# EAGLE design telemetry-daughter (EAGLE 7.7.0)
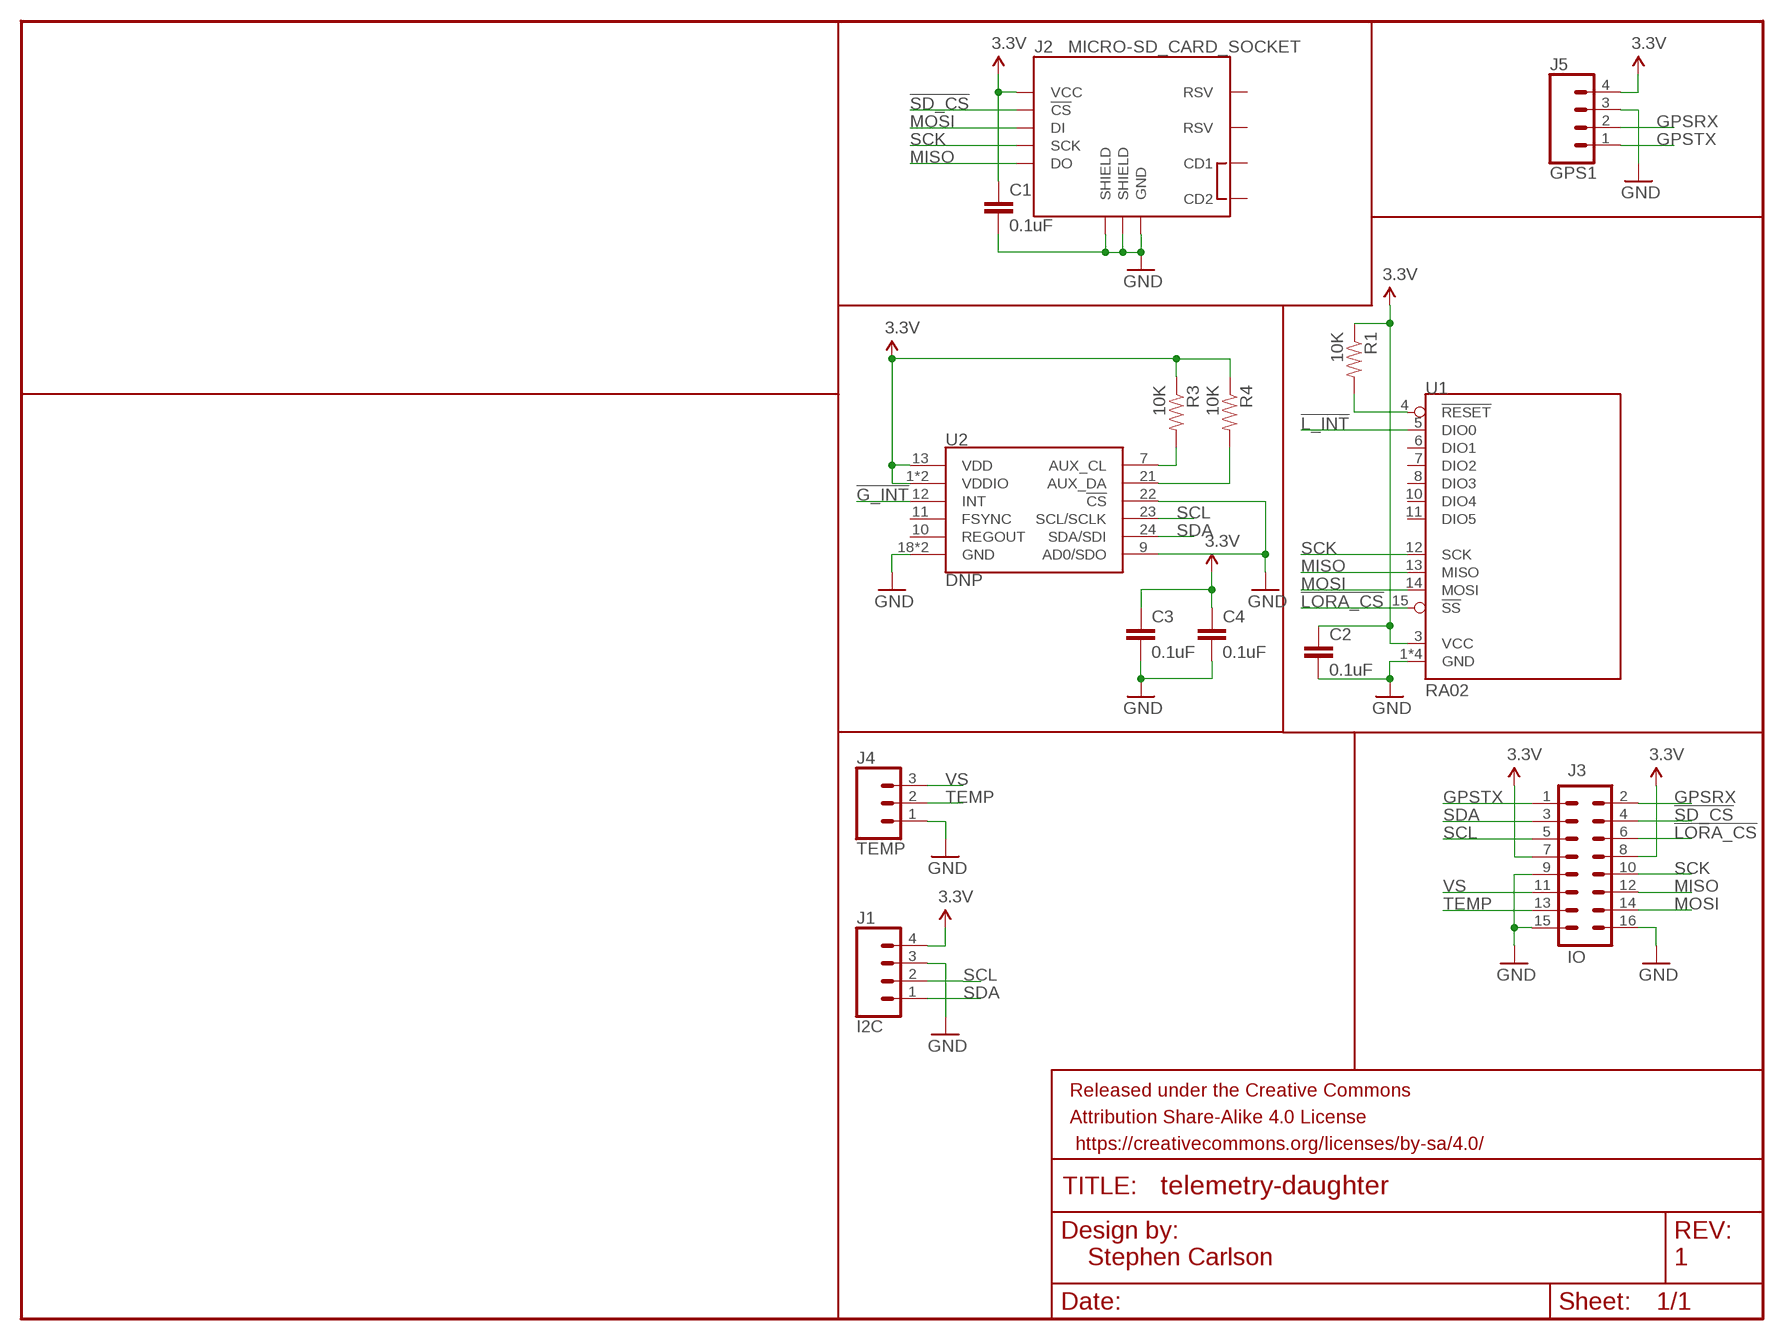
[diagram p0: schematic, sheet 1]

## Parts
C1  0.1uF  0.1UF-0603-25V-(+80/-20%)  [0603]
C2  0.1uF  0.1UF-0603-25V-(+80/-20%)  [0603]
C3  0.1uF  0.1UF-0603-25V-(+80/-20%)  [0603]
C4  0.1uF  0.1UF-0603-25V-(+80/-20%)  [0603]
FRAME1  FRAME-LETTERNO_PACKAGE  [DUMMY]
J1  I2C  CONN_04JST-PTH  [JST-4-PTH]
J2  MICRO-SD_CARD_SOCKET  [MICRO-SD-SOCKET]
J3  IO  M08X2  [2X8]
J4  TEMP  CONN_03JST-PTH  [JST-3-PTH]
J5  GPS1  CONN_04JST-PTH  [JST-4-PTH]
R1  10K  RESISTOR0805-RES  [0805]
R3  10K  RESISTOR0805-RES  [0805]
R4  10K  RESISTOR0805-RES  [0805]
U1  RA02  [RA02]
U2  DNP  MPU-9250  [QFN24-3X3]

## Nets
3.3V: C1.1 C2.1 C3.1 C4.1 J1.4 J2.VCC J3.7 J3.8 J5.4 R1.1 R3.1 R4.1 U1.3(VCC) U2.1(VDDIO) U2.8(VDDIO) U2.13(VDD)
!G_INT!: U2.12(INT)
!L_INT!: U1.5(DIO0)
!LORA_CS!: J3.6 U1.15(!SS!)
!LORA_RST!: R1.2 U1.4(!RESET!)
!SD_CS!: J2.CS(!CS) J3.4
AUX_CL: R3.2 U2.7(AUX_CL)
AUX_DA: R4.2 U2.21(AUX_DA)
GND: C1.2 C2.2 C3.2 C4.2 J1.3 J2.GND J2.GND1(SHIELD) J2.GND3(SHIELD) J3.9 J3.15 J3.16 J4.1 J5.3 U1.1(GND) U1.2(GND) U1.9(GND) U1.16(GND) U2.9(AD0/SDO) U2.18(GND) U2.20(GND) U2.22(!CS)
GPSRX: J3.2 J5.2
GPSTX: J3.1 J5.1
MISO: J2.DO J3.12 U1.13(MISO)
MOSI: J2.DI J3.14 U1.14(MOSI)
SCK: J2.SCLK(SCK) J3.10 U1.12(SCK)
SCL: J1.2 J3.5 U2.23(SCL/SCLK)
SDA: J1.1 J3.3 U2.24(SDA/SDI)
TEMP: J3.13 J4.2
VS: J3.11 J4.3
Unconnected: J2.CD1 J2.CD2 J2.RSV1(RSV) J2.RSV2(RSV) U1.6(DIO1) U1.7(DIO2) U1.8(DIO3) U1.10(DIO4) U1.11(DIO5) U2.10(REGOUT) U2.11(FSYNC)

## Notes on the sheet
- Stephen Carlson | 1

## Library data of the parts
C1-C4 = SparkFun-Capacitors:0.1UF: 0.1µF ceramic capacitors A capacitor is a passive two-terminal electrical component used to store electrical energy temporarily in an electric field.; PROD_ID: CAP-00810
FRAME1 = SparkFun-Aesthetics:FRAME-LETTER: Schematic Frame Standard 8.5x11 US Letter frame; DESIGNER: Nobody; VERSION: v01
J1 J5 = SparkFun-Connectors:CONN_04: Multi connection point. Often used as Generic Header-pin footprint for 0.1 inch spaced/style header connections On any of the 0.1 inch spaced packages, you can populate with these: Break Away Headers - Straight <https://www.sparkfun.com/products/116> (PRT-00116) Break Away Male Headers - Right Angle <https://www.sparkfun.com/products/553> (PRT-00553) Female Headers <https://www.sparkfun.com/products/115> (PRT-00115) Break Away Headers - Machine Pin <https://www.sparkfun.com/products/117> (PRT-00117) Break Away Female Headers - Swiss Machine Pin <https://www.sparkfun.com/products/743> (PRT-00743) For SCREWTERMINALS and SPRING TERMINALS visit here: Screw Terimnals on SparkFun.com <https://www.sparkfun.com/search/results?term=Screw+Terminals> (5mm/3.5mm/2.54mm spacing) This device is also useful as a general connection point to wire up your design to another part of your project. Our various solder wires solder well into these plated through hole pads. Hook-Up Wire - Assortment (Stranded, 22 AWG) <https://www.sparkfun.com/products/11375> (PRT-11375) Hook-Up Wire - Assortment (Solid Core, 22 AWG) <https://www.sparkfun.com/products/11367> (PRT-11367) View the entire wire category on our website here <https://www.sparkfun.com/categories/141> Special notes: Molex polarized connector foot print use with SKU : PRT-08231 with associated crimp pins and housings. 1MM SMD Version SKU: PRT-10208; PROD_ID: WIRE-13531; SF_ID: PRT-09916
J2 = SparkFun-Connectors:MICRO-SD_CARD_SOCKET: microSD Socket for Transflash Push-push type µSD socket. tDoc lines correctly indicate media card edge positions when inserting (unlocked, locked, depressed). NOTE: CD1 and CD2 are connected internally, and the default detect state of the socket is detect pin to ground. SparkFun Products: WAV Trigger <https://www.sparkfun.com/products/13660> CAN-Bus Shield <https://www.sparkfun.com/products/13262> SparkFun Level Shifing microSD Breakout <https://www.sparkfun.com/products/13743>; PROD_ID: CONN-07820; SF_ID: PRT-00127
J3 = SparkFun-Connectors:M08X2: .1" headers, two rows of 8 each
J4 = SparkFun-Connectors:CONN_03: Multi connection point. Often used as Generic Header-pin footprint for 0.1 inch spaced/style header connections On any of the 0.1 inch spaced packages, you can populate with these: Break Away Headers - Straight <https://www.sparkfun.com/products/116> (PRT-00116) Break Away Male Headers - Right Angle <https://www.sparkfun.com/products/553> (PRT-00553) Female Headers <https://www.sparkfun.com/products/115> (PRT-00115) Break Away Headers - Machine Pin <https://www.sparkfun.com/products/117> (PRT-00117) Break Away Female Headers - Swiss Machine Pin <https://www.sparkfun.com/products/743> (PRT-00743) Stackable Header - 3 Pin (Female, 0.1") <https://www.sparkfun.com/products/13875> (PRT-13875) For SCREWTERMINALS and SPRING TERMINALS visit here: Screw Terimnals on SparkFun.com <https://www.sparkfun.com/search/results?term=Screw+Terminals> (5mm/3.5mm/2.54mm spacing) This device is also useful as a general connection point to wire up your design to another part of your project. Our various solder wires solder well into these plated through hole pads. Hook-Up Wire - Assortment (Stranded, 22 AWG) <https://www.sparkfun.com/products/11375> (PRT-11375) Hook-Up Wire - Assortment (Solid Core, 22 AWG) <https://www.sparkfun.com/products/11367> (PRT-11367) View the entire wire category on our website here <https://www.sparkfun.com/categories/141> Special notes: Molex polarized connector foot print use with SKU : PRT-08232 with associated crimp pins and housings.; PROD_ID: WIRE-10037; SF_ID: PRT-09915
R1 R3 R4 = SparkFun-Passives:RESISTOR: Resistor Basic schematic elements and footprints for 0603, 1206, and PTH resistors.
U1 = HAB:RA02: RA-02 LoRA RA-02 LoRA module with integrated u.FL connector
U2 = SparkFun-Sensors:MPU-9250: MPU-9250 9 Degree of Freedom IMU System in Package that contains MPU-6500 & AK8963 NC pin 19. 2-6 & 14-17 not internally connected. May be used for PCB trace routing. Datasheet <https://cdn.sparkfun.com/assets/learn_tutorials/5/5/0/MPU9250REV1.0.pdf> SparkFun Products: SparkFun 9DoF Razor IMU M0 <https://www.sparkfun.com/products/14001> SparkFun IMU Breakout - MPU-9250 <https://www.sparkfun.com/products/13762>; PROD_ID: IC-13192; VALUE: 9DoF IMU

## Board
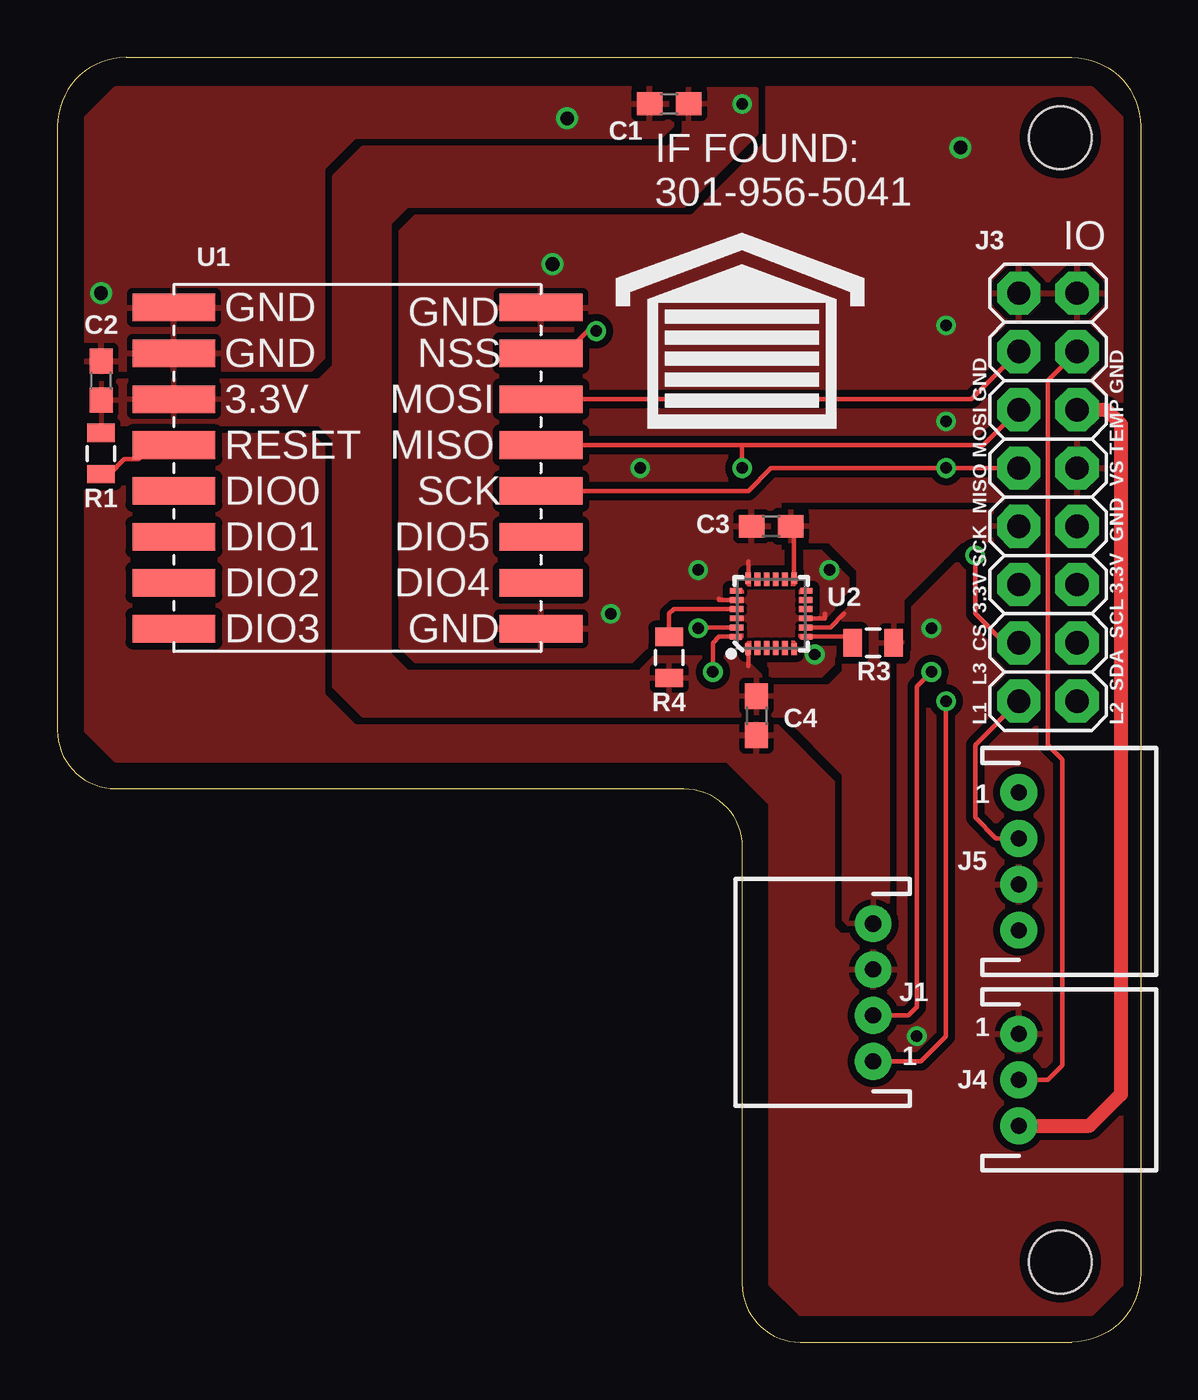
[diagram p1: board, top side]
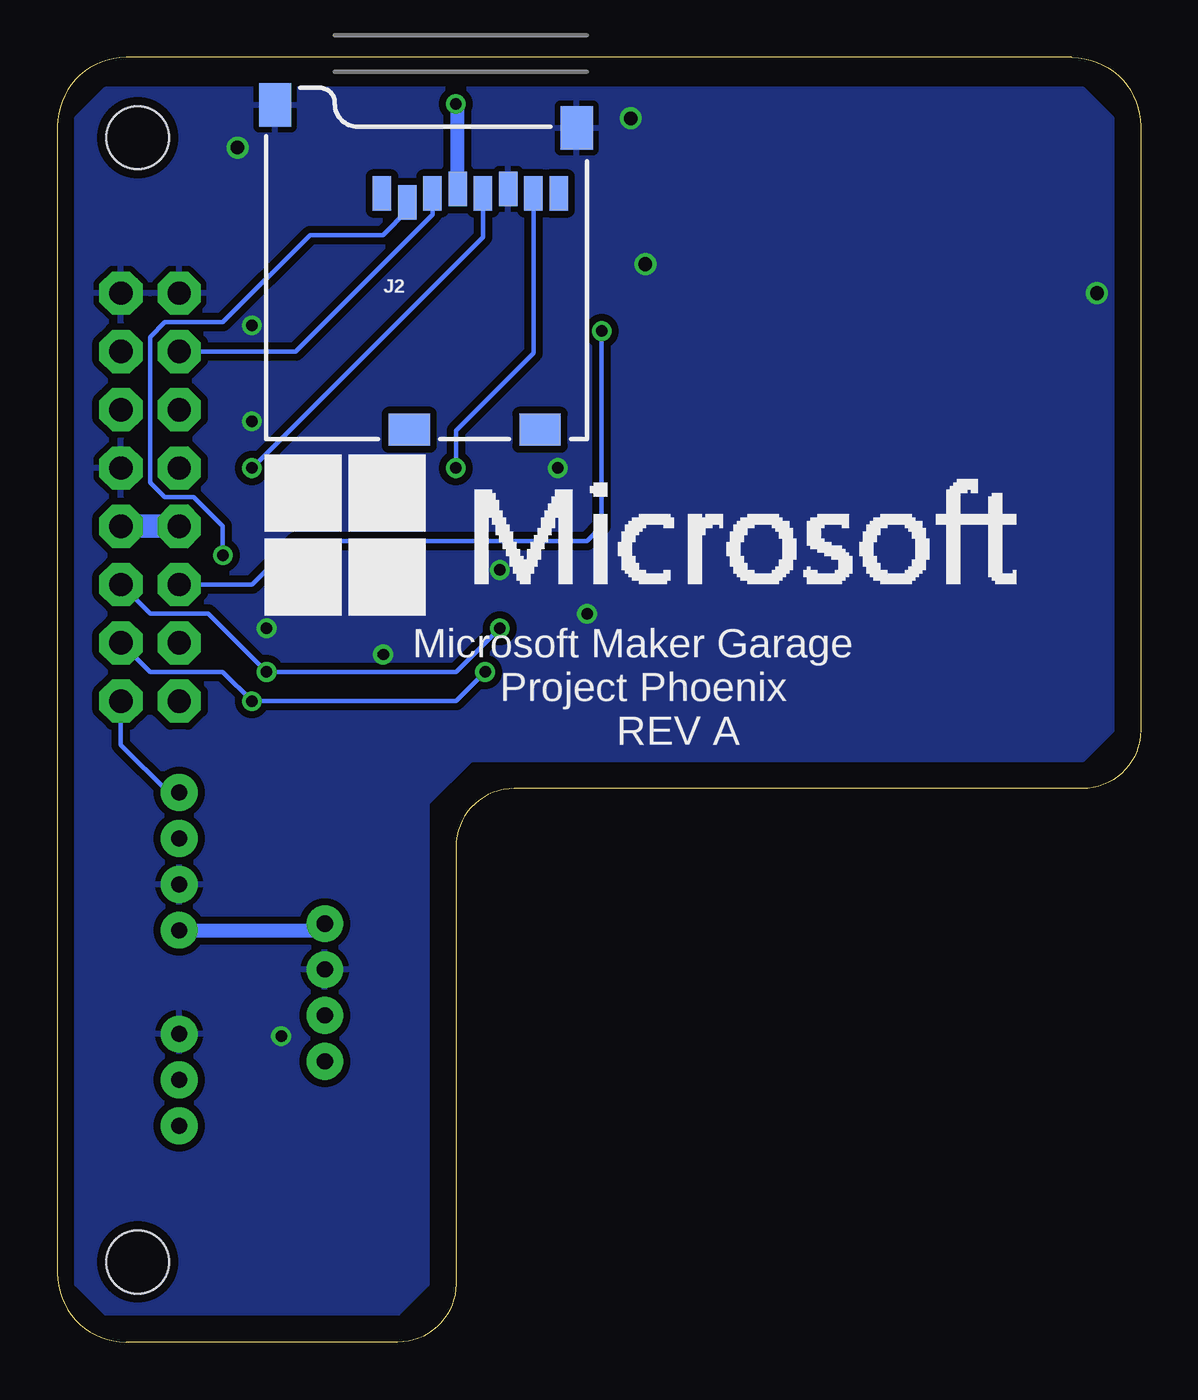
[diagram p2: board, bottom side, seen from below]

Size 47.22 x 56 mm. Coordinates in mm from the lower left corner, seen from the top.
Outline: 0,53 0,26.67 arc90 2.54,24.13 27.3,24.13 arc-90 29.84,21.59 29.84,2.54 arc90 32.38,0 44.22,0 arc90 47.22,3 47.22,53 arc90 44.22,56 3,56 arc90 0,53
Copper layers (1*16): Top 0.0356mm / dielectric 1.5011mm / Bottom 0.0356mm
Design rules "LaenPCBOrder *": minimum track width 6mil, minimum drill 13mil, track to track 6mil, track to pad 6mil, pad to pad 6mil, via to via 6mil, smd to smd 6mil, copper to edge 15mil, drill to drill 6mil, minimum pad ring 7mil, minimum via ring 7mil, stop-mask expansion 2.5mil, vias tented up to drill 0mil, thermal gap 10mil
Holes 2.75 mm at 43.72,3.5 43.72,52.5
tKeepout: area 40.7,0.5 to 46.7,6.5; area 40.7,49.5 to 46.7,55.5

### Footprints (pad centres in the part's own frame; a part is rotated, then mirrored left to right if it is on the bottom)
0603 = smd 1.1 x 1: 1 -0.85,0; 2 0.85,0
JST-4-PTH = drill 0.7 pad 1.6: 1 -3,0; 2 -1,0; 3 1,0; 4 3,0
MICRO-SD-SOCKET = smd 1.8 x 1.4: CD1 -2.05,0.4; CD2 -7.75,0.4 | smd 0.8 x 1.5: CS -7.84,10.3; DI -6.74,10.7; DO -2.34,10.7; GND -3.44,10.9; RSV1 -8.94,10.7; RSV2 -1.24,10.7; SCLK -4.54,10.7; VCC -5.64,10.9 | smd 1.4 x 1.9: GND1 -13.6,14.55; GND3 -0.45,13.55
2X8 = drill 1.016 pad 1.88 octagon: 1 0,0; 2 0,2.54; 3 2.54,0; 4 2.54,2.54; 5 5.08,0; 6 5.08,2.54; 7 7.62,0; 8 7.62,2.54; 9 10.16,0; 10 10.16,2.54; 11 12.7,0; 12 12.7,2.54; 13 15.24,0; 14 15.24,2.54; 15 17.78,0; 16 17.78,2.54
JST-3-PTH = drill 0.7 pad 1.6: 1 -2,0; 2 0,0; 3 2,0
0805 = smd 0.8 x 1.2: 1 -0.9,0; 2 0.9,0
RA02 = smd 3.6 x 1.2: 1 -8,7; 2 -8,5; 3 -8,3; 4 -8,1; 5 -8,-1; 6 -8,-3; 7 -8,-5; 8 -8,-7; 9 8,-7; 10 8,-5; 11 8,-3; 12 8,-1; 13 8,1; 14 8,3; 15 8,5; 16 8,7
QFN24-3X3 = smd 0.495 x 0.25: 1 -1.552,1; 6 -1.552,-1; 13 1.552,-1; 18 1.552,1 | smd 0.6 x 0.25: 2 -1.5,0.6; 3 -1.5,0.2; 4 -1.5,-0.2; 5 -1.5,-0.6; 14 1.5,-0.6; 15 1.5,-0.2; 16 1.5,0.2; 17 1.5,0.6 | smd 0.25 x 0.495: 7 -1,-1.552; 12 1,-1.552; 19 1,1.552; 24 -1,1.552 | smd 0.25 x 0.6: 8 -0.6,-1.5; 9 -0.2,-1.5; 10 0.2,-1.5; 11 0.6,-1.5; 20 0.6,1.5; 21 0.2,1.5; 22 -0.2,1.5; 23 -0.6,1.5

### Placement (x,y rotation side)
C1  26.67,53.98 180 top
C2  1.9,41.91 90 top
C3  31.12,35.56 180 top
C4  30.48,27.3 270 top
FRAME1  -17.78,57.15 0 top  (outside the outline)
J1  35.56,15.24 90 top
J2  24.13,39.37 0 bottom
J3  44.45,27.94 90 top
J4  41.91,11.43 270 top
J5  41.91,20.95 270 top
R1  1.9,38.73 270 top
R3  35.56,30.48 180 top
R4  26.67,29.84 90 top
U1  13.08,38.1 0 top
U2  31.12,31.75 90 top
U$1  [GARAGE]  29.84,43.18 0 top
U$2  [MSFT_LOGO]  19.05,34.92 0 bottom

### Tracks (layer width: path | path; a pad name or v marks a point on that pad's centre or on a via)
3.3V  (via drill 0.5)
  Top 0.203: U2.1 30.12,29.48 | U2.13 32.12,35.41 C3.1 | U2.8 33.69,31.15 34.29,31.75
  Bottom 0.61: J5.4 35.84,17.95 J1.4 | J2.VCC 29.77,53.9 v29.84,53.98
  Bottom 1.016: J3.8 J3.7
  pour Top (isolate 0.305, rank 2): 27.3,54.61 27.3,52.7 26.67,52.07 13.33,52.07 12.06,50.8 12.06,42.55 11.43,41.91 1.9,41.91 1.9,40.01 11.43,40.01 12.06,39.37 12.06,28.57 13.33,27.3 31.75,27.3 34.29,24.77 34.29,18.41 34.92,17.78 36.2,17.78 36.2,30.48 36.83,30.48 36.83,32.38 39.37,34.92 42.55,34.92 42.55,36.2 31.75,36.2 31.75,34.92 33.66,34.92 34.92,33.66 34.92,32.38 34.29,31.75 34.29,29.21 33.66,28.57 31.12,28.57 29.84,29.84 26.03,29.84 25.4,29.21 15.24,29.21 14.48,29.97 14.48,48.77 15.24,49.53 27.3,49.53 30.48,52.7 30.48,54.61
!LORA_CS!  (via drill 0.5)
  Top 0.203: U1.15 22.14,43.1 23.11,44.07 v23.49,44.07
  Bottom 0.203: J3.6 38.73,33.02 36.83,34.92 24.13,34.92 23.49,35.56 v23.49,44.07
!LORA_RST!
  Top 0.203: R1.2 2.27,37.84 2.92,38.48 3.56,38.48 4.17,39.1 U1.4
!SD_CS!  (via drill 0.5)
  Top 0.203: J3.4 41.27,30.48 40,31.75 v40,34.29
  Bottom 0.203: J2.CS 31.97,49.31 33.02,48.26 36.2,48.26 40,44.45 42.55,44.45 43.18,43.81 43.18,37.47 42.55,36.83 41.27,36.83 40,35.56 v40,34.29
AUX_CL
  Top 0.203: U2.7 34.39,30.75 R3.2
AUX_DA
  Top 0.203: U2.21 26.87,31.95 26.67,31.75 R4.2
GND  (via drill 0.5, 0.6)
  Top 0.203: U2.18 30.12,34.02 | U2.20 28.83,32.35 28.83,32.41 | U2.9 33.45,31.55 33.45,31.75
  other vias: 33.66,33.66 33.02,29.97 21.59,46.99 22.23,53.34 39.37,52.07 27.94,33.66 25.4,38.1 38.73,44.32 24.13,31.75 1.9,45.72 37.46,13.34 38.1,31.11 38.73,40.13
  pour Top (isolate 0.305, rank 3): 1.27,53.34 1.27,26.67 2.54,25.4 29.21,25.4 31.12,23.5 31.12,2.54 32.38,1.27 45.09,1.27 46.36,2.54 46.36,53.34 45.09,54.61 2.54,54.61
  pour Bottom (isolate 0.305, rank 3): 45.09,54.61 2.54,54.61 1.27,53.34 1.27,26.67 2.54,25.4 29.21,25.4 31.12,23.5 31.12,2.54 32.38,1.27 45.09,1.27 46.36,2.54 46.36,53.34
  pour Top (no thermals): 29.84,33.02 29.84,30.48 32.38,30.48 32.38,33.02
GPSRX
  Top 0.203: J5.2 40.91,21.95 40,22.86 40,26.04 J3.2
GPSTX
  Bottom 0.203: J5.1 42.37,23.95 44.45,26.04 J3.1
MISO  (via drill 0.5)
  Top 0.203: U1.13 29.84,39.1 | 29.84,39.1 40.37,39.1 J3.12 | v29.84,38.1 29.84,39.1
  Bottom 0.203: J2.DO 26.47,43.11 29.84,39.73 v29.84,38.1
MOSI
  Top 0.203: U1.14 39.83,41.1 J3.14
  Bottom 0.203: J2.DI 30.87,49.14 36.83,43.18 J3.14
SCK  (via drill 0.5)
  Top 0.203: U1.12 30.12,37.1 31.12,38.1 v38.73,38.1 J3.10
  Bottom 0.203: v38.73,38.1 28.67,48.16 J2.SCLK
SCL  (via drill 0.5)
  Top 0.203: v38.1,29.21 37.46,28.57 37.46,14.61 37.1,14.24 J1.2 | U2.23 27.98,31.15 v27.94,31.11
  Bottom 0.203: J3.5 43.18,31.75 40.64,31.75 v38.1,29.21 29.84,29.21 v27.94,31.11
SDA  (via drill 0.5)
  Top 0.203: v38.73,27.94 38.73,13.34 37.64,12.24 J1.1 | U2.24 28.84,30.75 28.57,30.48 v28.57,29.21
  Bottom 0.203: J3.3 43.18,29.21 40,29.21 v38.73,27.94 29.84,27.94 v28.57,29.21
TEMP
  Top 0.203: J3.13 43.18,41.91 43.18,26.04 43.81,25.4 43.81,12.06 43.18,11.43 J4.2
VS
  Top 0.61: J3.11 45.72,40.64 46.36,40.01 46.36,10.79 44.99,9.43 J4.3

### Text on the board
tPlace: IF FOUND: | 301-956-5041 | L1 L3 CS 3.3V SCK MISO MOSI GND | L2 SDA SCL 3.3V GND VS TEMP GND | 1 | 1 | 1
bPlace: Microsoft Maker Garage | Project Phoenix | REV A